# Altium schematic sheet Aux_Outputs.SchDoc: RP2040 CNC
size B; Author: AM; CompanyName: Expatria Technologies; DrawnBy: A.Marles; Engineer: AM; Organization: Expatria Technolgoies; DocumentNumber: 10; SheetNumber: 10; SheetTotal: 14
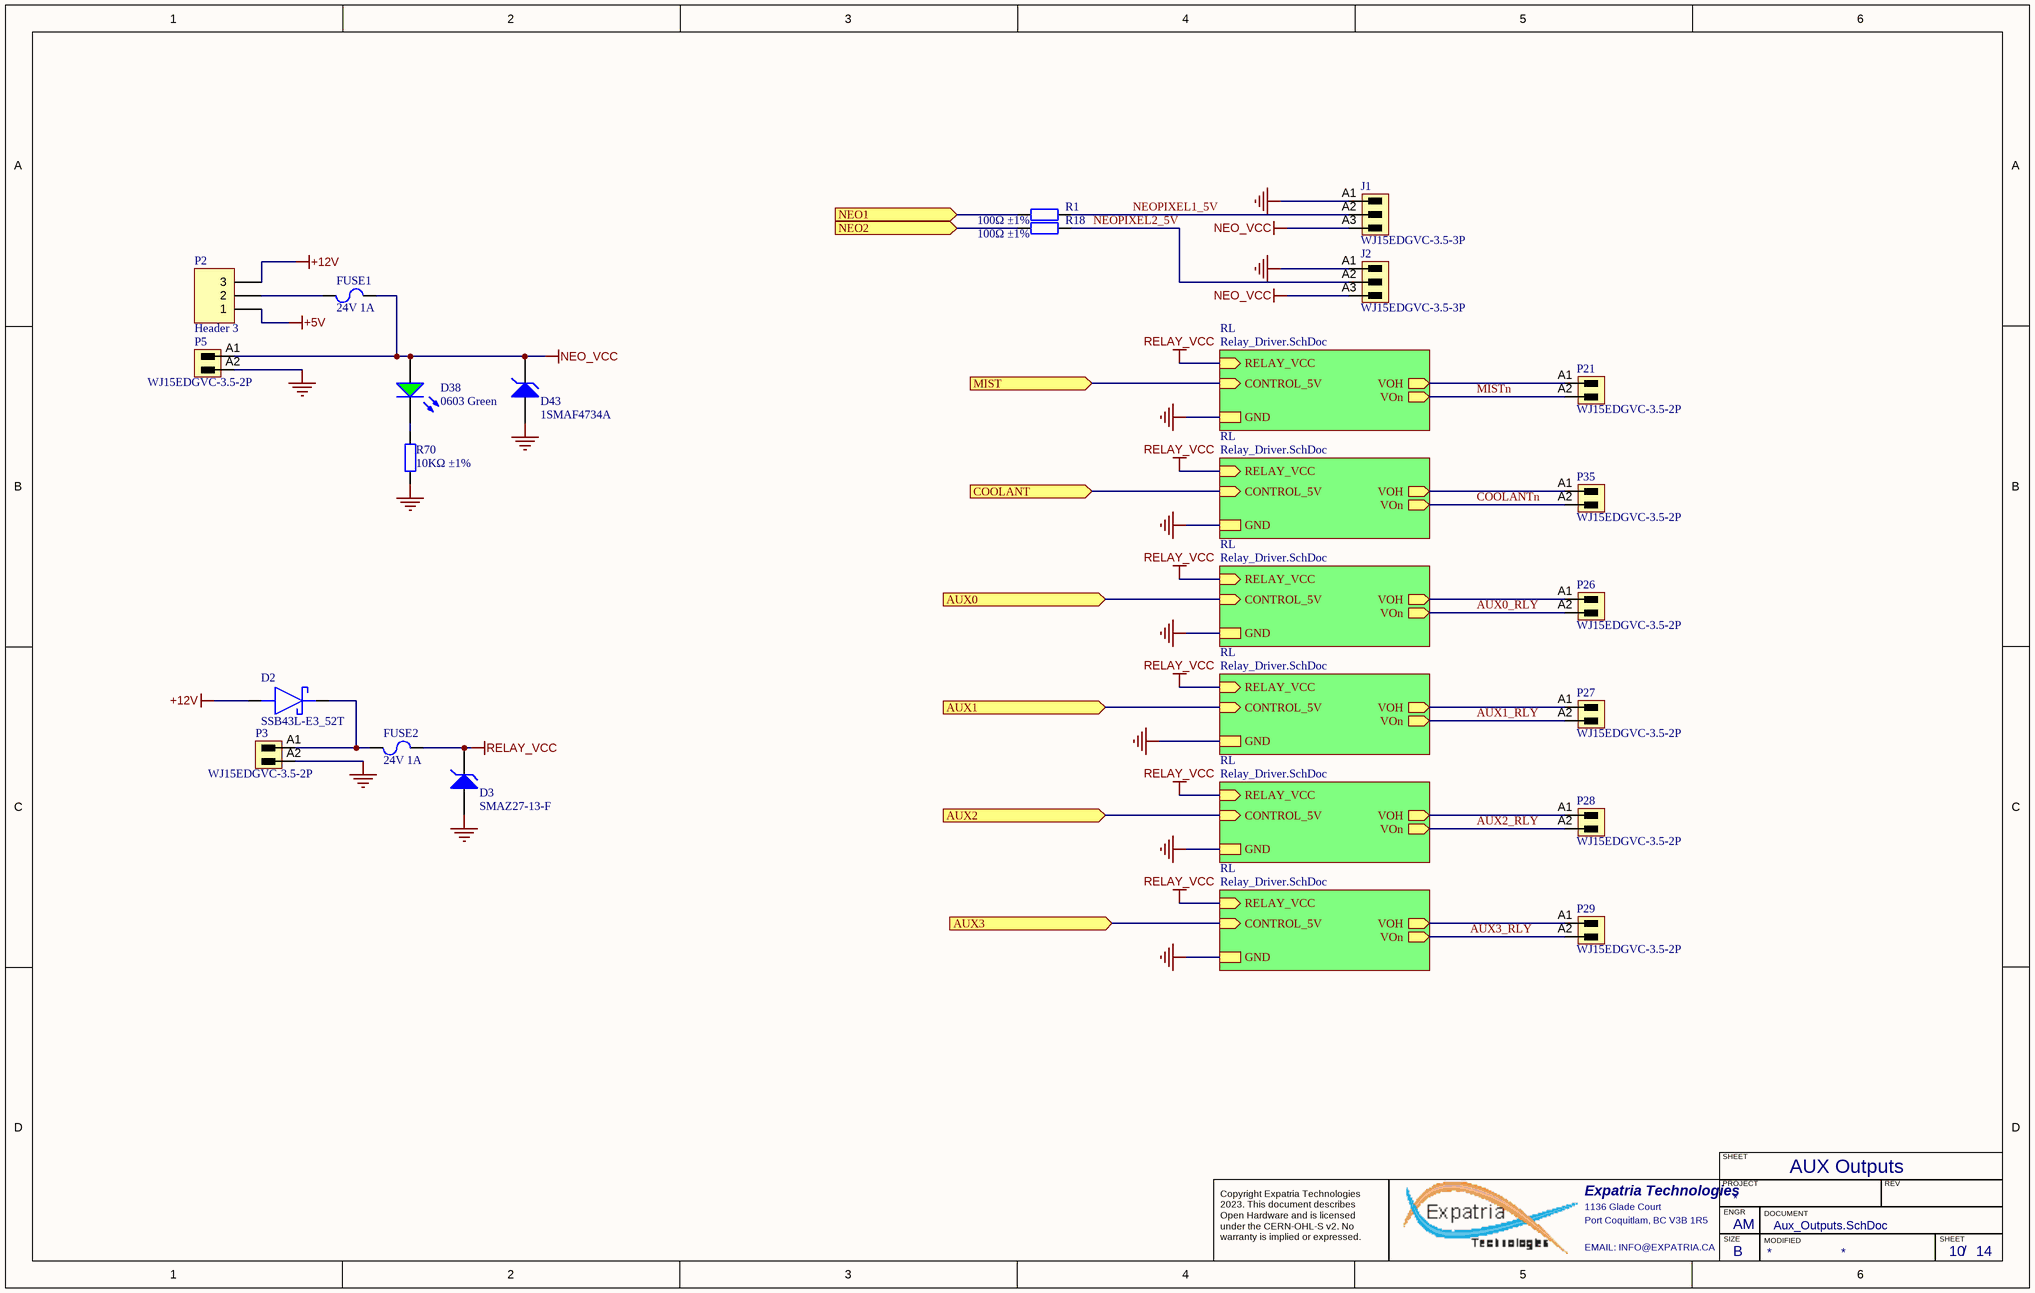
[diagram p0: Aux_Outputs.SchDoc]

## Parts
D2  SSB43L-E3_52T  [DIOM5436X244N]
D3  SMAZ27-13-F  [DIOM5226X240N]
D38  0603 Green  [0603_LED_S1]
D43  1SMAF4734A  [DIOM5226X240N]
FUSE1  24V 1A  [1206_C]
FUSE2  24V 1A  [1206_C]
J1  WJ15EDGVC-3.5-3P  [691321100003 - 3.5mm  3p]
J2  WJ15EDGVC-3.5-3P  [691321100003 - 3.5mm  3p]
P2  Header 3  [HDR1X3]
P3  WJ15EDGVC-3.5-2P  [691321100002]
P5  WJ15EDGVC-3.5-2P  [691321100002]
P21  WJ15EDGVC-3.5-2P  [691321100002]
P26  WJ15EDGVC-3.5-2P  [691321100002]
P27  WJ15EDGVC-3.5-2P  [691321100002]
P28  WJ15EDGVC-3.5-2P  [691321100002]
P29  WJ15EDGVC-3.5-2P  [691321100002]
P35  WJ15EDGVC-3.5-2P  [691321100002]
R1  100Ω ±1%  [0603_R]
R18  100Ω ±1%  [0603_R]
R70  10KΩ ±1%  [0603_R]

## Sub-sheets
RL = Relay_Driver.SchDoc: CONTROL_5V (in), VOn (out), VOH (out), RELAY_VCC (in), GND
RL = Relay_Driver.SchDoc: CONTROL_5V (in), VOn (out), VOH (out), RELAY_VCC (in), GND
RL = Relay_Driver.SchDoc: CONTROL_5V (in), VOn (out), VOH (out), RELAY_VCC (in), GND
RL = Relay_Driver.SchDoc: CONTROL_5V (in), VOn (out), VOH (out), RELAY_VCC (in), GND
RL = Relay_Driver.SchDoc: CONTROL_5V (in), VOn (out), VOH (out), RELAY_VCC (in), GND
RL = Relay_Driver.SchDoc: CONTROL_5V (in), VOn (out), VOH (out), RELAY_VCC (in), GND

## Ports
AUX0 (in), AUX1 (in), AUX2 (in), AUX3 (in), COOLANT (in), MIST (in), NEO1 (in), NEO2 (in)

## Nets
+5V: P2.1
+12V: D2.1(A) P2.3
GND: D3.1(A) D43.1(A) J1.A1 J2.A1 P3.A2 P5.A2 R70.1 ; sheet RL/GND, sheet RL/GND, sheet RL/GND, sheet RL/GND, sheet RL/GND, sheet RL/GND
NEO_VCC: D38.A D43.2(K) FUSE1.2 J1.A3 J2.A3 P5.A1
RELAY_VCC: D3.2(K) FUSE2.2 ; sheet RL/RELAY_VCC, sheet RL/RELAY_VCC, sheet RL/RELAY_VCC, sheet RL/RELAY_VCC, sheet RL/RELAY_VCC, sheet RL/RELAY_VCC
AUX0: port AUX0, sheet RL/CONTROL_5V
AUX0_RLY: P26.A2 ; sheet RL/VOn
AUX1: port AUX1, sheet RL/CONTROL_5V
AUX1_RLY: P27.A2 ; sheet RL/VOn
AUX2: port AUX2, sheet RL/CONTROL_5V
AUX2_RLY: P28.A2 ; sheet RL/VOn
AUX3: port AUX3, sheet RL/CONTROL_5V
AUX3_RLY: P29.A2 ; sheet RL/VOn
COOLANT: port COOLANT, sheet RL/CONTROL_5V
COOLANTn: P35.A2 ; sheet RL/VOn
MIST: port MIST, sheet RL/CONTROL_5V
MISTn: P21.A2 ; sheet RL/VOn
NEO1: R1.1 ; port NEO1
NEO2: R18.1 ; port NEO2
NEOPIXEL1_5V: J1.A2 R1.2
NEOPIXEL2_5V: J2.A2 R18.2
NetD2_2: D2.2(K) FUSE2.1 P3.A1
NetD38_K: D38.K R70.2
NetFUSE1_1: FUSE1.1 P2.2
NetP21_A1: P21.A1 ; sheet RL/VOH
NetP26_A1: P26.A1 ; sheet RL/VOH
NetP27_A1: P27.A1 ; sheet RL/VOH
NetP28_A1: P28.A1 ; sheet RL/VOH
NetP29_A1: P29.A1 ; sheet RL/VOH
NetP35_A1: P35.A1 ; sheet RL/VOH

## Notes on the sheet
- AUX Outputs
- SHEET
- Expatria Technologies
- 1136 Glade Court
- Port Coquitlam, BC V3B 1R5
- PROJECT
- SIZE
- ENGR
- MODIFIED
- DOCUMENT
- REV
- Copyright Expatria Technologies 2023. This document describes Open Hardware and is licensed under the CERN-OHL-S v2. No warranty is implied or expressed.
- EMAIL: INFO@EXPATRIA.CA
- B
- /

## Library data of the parts
D2 = SSB43L-E3_52T: Rectifier Diode Schottky 30V 4A 2-Pin SMB T/R / DIODE SCHOTTKY 30V 4A DO214AA; Manufacturer_Name: Vishay; Manufacturer_Part_Number: SSB43L-E3/52T; Manufacturer: Vishay Semiconductors; Forward Voltage: 450mV; Max Reverse Current: 600uA; Peak Non-Repetitive Surge Current: 100A; Element Configuration: Single; Polarity: Standard; Value: SSB43L-E3/52T; ComponentLink1Description: https://datasheet.ciiva.com/4245/ssb43l-4245635.pdf?src-supplier=Arrow+Electronics; ComponentLink1URL: https://datasheet.ciiva.com/4245/ssb43l-4245635.pdf?src-supplier=Arrow+Electronics; Supplier: LCSC; SuppliersPartNumber: C222519; Datasheet Link: https://componentsearchengine.com/Datasheets/2/SSB43L-E3_52T.pdf; Height: 2.44mm; Supplier 1: LCSC; Supplier Part Number 1: C222519; Manufacturer Part Number: SSB43L-E3/52T; RoHS: Yes; Category: Rectifier Diodes; Stock 1: 283; Pricing 1: 1=0.35480, 10=0.28480, 30=0.25460, 100=0.21800, 750=0.20210, 1500=0.19100 (USD); Mount: Surface Mount; Case/Package: DO-214AA; Number of Pins: 2; Contact Plating: Tin,Matte; Min Operating Temperature: -65°C; Max Operating Temperature: 150°C; Packaging: Tape and Reel; Forward Current: 4A; Package Quantity: 1; Average Rectified Current: 4A; Max Repetitive Reverse Voltage (Vrrm): 30V; Max Forward Surge Current (Ifsm): 100A; Max Reverse Voltage (DC): 30V; Max Surge Current: 100A; Max Reverse Leakage Current: 600uA; Voltage Rating (DC): 30V; Current Rating: 4A; Output Current: 4A; Length: 4.7mm; Width: 3.8mm; Radiation Hardening: No; Lead Free: Lead Free; RoHS Compliant: Yes; ComponentLink2URL: https://datasheet.ciiva.com/15224/getdatasheetpartid-99263-15224680.pdf?src-supplier=Verical; ComponentLink2Description: https://datasheet.ciiva.com/15224/getdatasheetpartid-99263-15224680.pdf?src-supplier=Verical; ComponentLink3URL: https://datasheet.ciiva.com/14634/0900766b80dd0508-14634162.pdf?src-supplier=Allied+Electronics; ComponentLink3Description: https://datasheet.ciiva.com/14634/0900766b80dd0508-14634162.pdf?src-supplier=Allied+Electronics; ComponentLink4URL: https://datasheet.ciiva.com/7962/64541-7962449.pdf?src-supplier=Element14; ComponentLink4Description: https://datasheet.ciiva.com/7962/64541-7962449.pdf?src-supplier=Element14; ComponentLink5URL: https://datasheet.ciiva.com/18434/70217334-18434422.pdf?src-supplier=Allied+Electronics; ComponentLink5Description: https://datasheet.ciiva.com/18434/70217334-18434422.pdf?src-supplier=Allied+Electronics
D3 D43 = BZT52C27: 27V ±5% 1W 500nA @ 20.5V SMA(DO-214AC) Zener Diodes RoHS; ComponentLink1Description: 供应商链接; ComponentLink1URL: http://www.szlcsc.com/product/details_8541.html; Supplier: LC
  D3: Package: SMA(DO-214AC); SuppliersPartNumber: C155318
  D43: Package: SMAF; SuppliersPartNumber: C169539
D38 = 0603 LED Green: LED; ComponentLink1Description: 供应商链接; ComponentLink1URL: http://www.szlcsc.com/product/details_73152.html; Package: 0603; Supplier: LC; SuppliersPartNumber: C72043; Color: Green
FUSE1 FUSE2 = JK-nSMD050-24: 24V 1A 0.1s 1206 PTC Resettable Fuses RoHS; Manufacturer: Jinrui Electronic Materials Co.; Package: 1206; Supplier: LC; SuppliersPartNumber: C369160; PartNumber: JK-nSMD050-24
J1 J2 = 3.5mm Terminal Header 3p: Header,Male Pin,Covered(4 Sided) 3 1 0.138"（3.50mm） 3 P=3.5mm Pluggable System Terminal Block RoHS; Manufacturer: Ningbo Kangnex Elec; Pitch_mm: 3.5 mm; UL_94_flammability_rating: V-0; Side_termination_characteristic: closed side; Solder_pin_length_mm: 3.2 mm; Short_text_for_material: SL 3.50/03/180G 3.2SN OR BX; Pitch_inch: 0.138 inch; PartNumber: WJ15EDGVC-3.5-3P; PackageReference: SL_3_50_180G_03; ComponentLink1URL: http://www.weidmueller.com/; ComponentLink1Description: Manufacturer URL; Packaging: Box; Revision: V1; SuppliersPartNumber: C192778; Manufacturer 1: Ningbo Kangnex Elec; Manufacturer Part Number 1: WJ15EDGVC-3.5-3P; Package: P=3.5mm
P2 = Header 3: Header, 3-Pin; Publisher: Altium Limited; SuppliersPartNumber: C49257
P3 P5 P21 P26-P29 P35 = 3.5mm Terminal Header 2p: Header,Male Pin,Covered(4 Sided) 2 1 0.138"（3.50mm） 2 P=3.5mm Pluggable System Terminal Block RoHS; Manufacturer: Weidmueller; Manufacturer 1: Weidmuller; Manufacturer Part Number 1: 1604470000; UL_94_flammability_rating: V-0; Pitch_mm: 3.5 mm; Side_termination_characteristic: closed side; Pitch_inch: 0.138 inch; Solder_pin_length_mm: 3.2 mm; Short_text_for_material: SL 3.50/02/180G 3.2SN OR BX; ComponentLink1Description: Manufacturer URL; ComponentLink1URL: http://www.weidmueller.com/; PartNumber: WJ15EDGVC-3.5-2P; Revision: V1; PackageReference: SL_3_50_180G_02; Packaging: Box; SuppliersPartNumber: C192777
R1 R18 = 0603 100R (1000) 1%: Chip resistor; Manufacturer: Uniroyal Elec; PartNumber: 0603WAF1000T5E; Power: 1/10W; ComponentLink1Description: Supplier link; ComponentLink1URL: http://www.szlcsc.com/product/details_23502.html; Package: 0603; Supplier: LC; SuppliersPartNumber: C22775; Resistance: 100Ω; Tolerance: 1%
R70 = 0603 10K (1002) 1%: Chip resistor; Manufacturer: Uniroyal Elec; PartNumber: 0603WAF1002T5E; Power: 1/10W; ComponentLink1Description: Supplier link; ComponentLink1URL: http://www.szlcsc.com/product/details_26547.html; Package: 0603; Supplier: LC; SuppliersPartNumber: C25804; Resistance: 10KΩ; Tolerance: 1%